# EAGLE design led_simple_breakout (EAGLE 6.5.0)
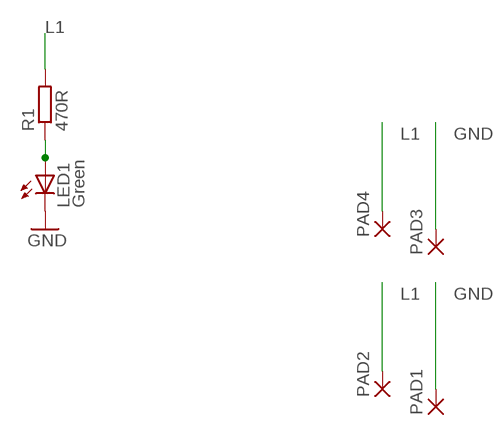
[diagram p0: schematic, sheet 1]

## Parts
LED1  Green  LEDCHIPLED_1206  [CHIPLED_1206]
PAD1  SMD2  [SMD1,27-2,54]
PAD2  SMD2  [SMD1,27-2,54]
PAD3  SMD2  [SMD1,27-2,54]
PAD4  SMD2  [SMD1,27-2,54]
R1  470R  R-EU_R0805  [R0805]

## Nets
GND [GND]: LED1.C PAD1.1(P) PAD3.1(P)
L1: PAD2.1(P) PAD4.1(P) R1.2
N$4: LED1.A R1.1

## Library data of the parts
LED1 = adafruit:LED: LED OSRAM: - CHIPLED LG R971, LG N971, LY N971, LG Q971, LY Q971, LO R971, LY R971 LH N974, LH R974 LS Q976, LO Q976, LY Q976 LO Q996 - Hyper CHIPLED LW Q18S LB Q993, LB Q99A, LB R99A - SideLED LS A670, LO A670, LY A670, LG A670, LP A670 LB A673, LV A673, LT A673, LW A673 LH A674 LY A675 LS A676, LA A676, LO A676, LY A676, LW A676 LS A679, LY A679, LG A679 - Hyper Micro SIDELED® LS Y876, LA Y876, LO Y876, LY Y876 LT Y87S - SmartLED LW L88C, LW L88S LB L89C, LB L89S, LG L890 LS L89K, LO L89K, LY L89K LS L896, LA L896, LO L896, LY L896 - TOPLED LS T670, LO T670, LY T670, LG T670, LP T670 LSG T670, LSP T670, LSY T670, LOP T670, LYG T670 LG T671, LOG T671, LSG T671 LB T673, LV T673, LT T673, LW T673 LH T674 LS T676, LA T676, LO T676, LY T676, LB T676, LH T676, LSB T676, LW T676 LB T67C, LV T67C, LT T67C, LS T67K, LO T67K, LY T67K, LW E67C LS E67B, LA E67B, LO E67B, LY E67B, LB E67C, LV E67C, LT E67C LW T67C LS T679, LY T679, LG T679 LS T770, LO T770, LY T770, LG T770, LP T770 LB T773, LV T773, LT T773, LW T773 LH T774 LS E675, LA E675, LY E675, LS T675 LS T776, LA T776, LO T776, LY T776, LB T776 LHGB T686 LT T68C, LB T68C - Hyper Mini TOPLED® LB M676 - Mini TOPLED Santana® LG M470 LS M47K, LO M47K, LY M47K Source: http://www.osram.convergy.de/
PAD1-PAD4 = wirepad:SMD2: SMD PAD
R1 = resistor:R-EU_: RESISTOR, European symbol

## Net classes
0 default: width 0.305 mm, drill 0.508 mm
1 GND: width 0.61 mm, drill 0.508 mm
2 VCC: width 0.61 mm, drill 0.508 mm

## Board
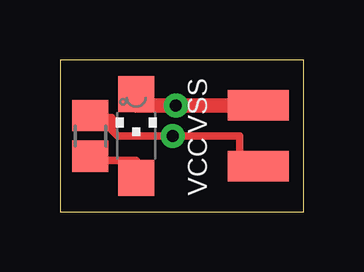
[diagram p1: board, top side]
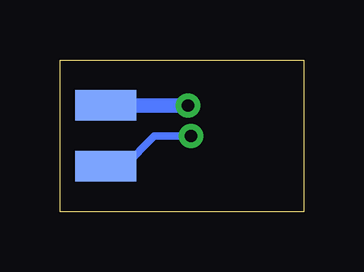
[diagram p2: board, bottom side, seen from below]

Size 10.16 x 6.35 mm. Coordinates in mm from the lower left corner, seen from the top.
Outline: 0,0 10.16,0 10.16,6.35 0,6.35 0,0
Copper layers (1*16): Top 0.035mm / dielectric 1.5mm / Bottom 0.035mm
Design rules "SparkFun *": minimum track width 12mil, minimum drill 20mil, track to track 8mil, track to pad 8mil, pad to pad 8mil, via to via 8mil, smd to smd 8mil, copper to edge 10mil, drill to drill 8mil, minimum pad ring 12mil, minimum via ring 10mil, stop-mask expansion 4mil, vias tented up to drill 25mil, thermal gap 10mil

### Footprints (pad centres in the part's own frame; a part is rotated, then mirrored left to right if it is on the bottom)
CHIPLED_1206 = smd 1.5 x 1.5: A 0,-1.75; C 0,1.75
SMD1,27-2,54 = smd 1.27 x 2.54: 1 0,0
R0805 = smd 1.3 x 1.5: 1 -0.85,0; 2 0.85,0

### Placement (x,y rotation side)
LED1  3.18,3.18 0 top
PAD1  8.25,4.45 90 top
PAD2  8.25,1.91 90 top
PAD3  8.25,4.45 90 bottom
PAD4  8.25,1.91 90 bottom
R1  1.27,3.18 90 top

### Tracks (layer width: path | path; a pad name or v marks a point on that pad's centre or on a via)
GND  (via drill 0.51)
  Top 0.61: PAD3.1 v4.83,4.45 3.18,4.45 LED1.C
  Bottom 0.61: v4.83,4.45 PAD3.1
L1  (via drill 0.51)
  Top 0.305: R1.2 1.4,3.94 2.16,3.94 2.16,3.43 2.41,3.18 v4.7,3.18 7.49,3.18 7.49,1.91 PAD4.1
  Bottom 0.305: v4.7,3.18 6.22,3.18 7.49,1.91 PAD4.1
N$4
  Top 0.305: LED1.A 3.18,2.16 1.4,2.16 R1.1

### Text on the board
tNames: VSS | VCC